# EAGLE design main (EAGLE 9.0.0)
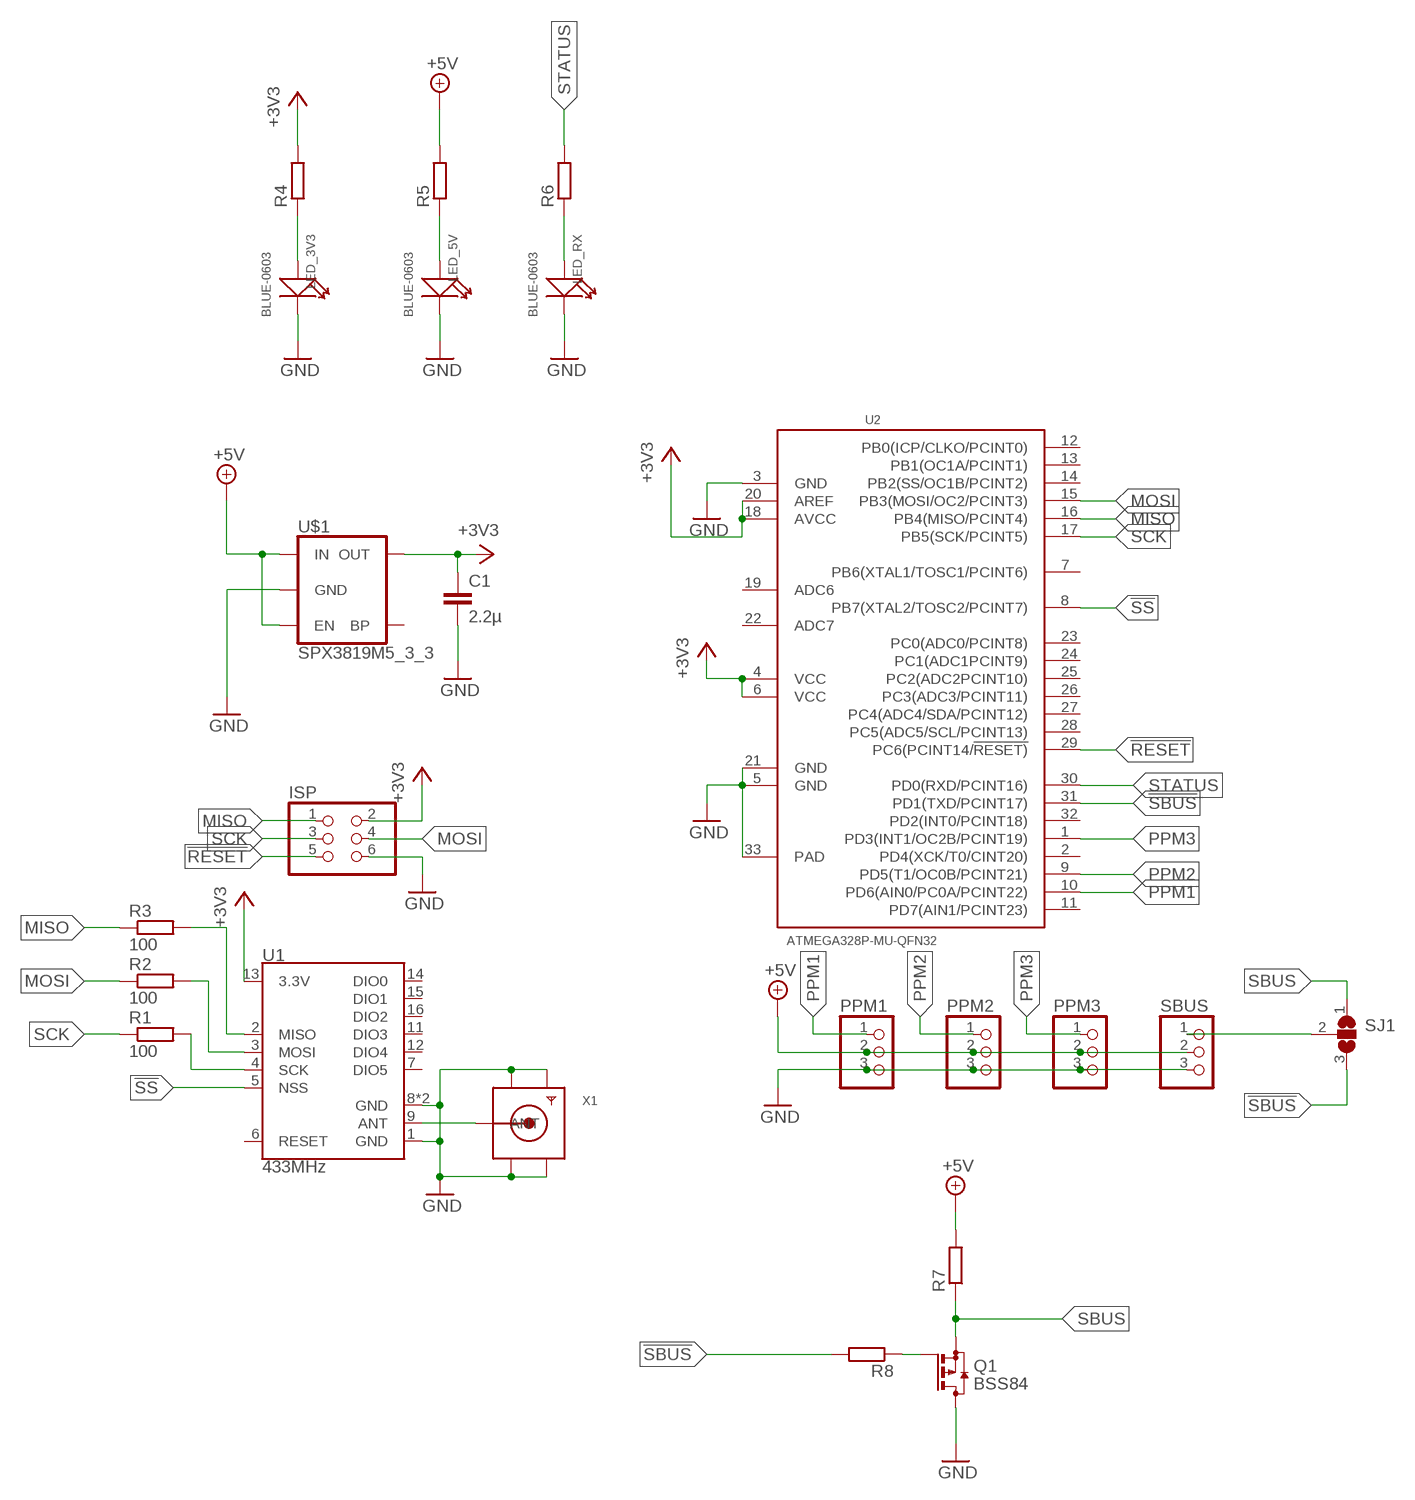
[diagram p0: schematic, sheet 1]

## Parts
C1  2.2µ  C-EUC0603  [C0603]
ISP  PINHD-2X3_2.54-SMD  [2X03SMD]
LED_3V3  BLUE-0603  SMD-LED-CLEAR-BLUE(0603)  [LED-0603]
LED_5V  BLUE-0603  SMD-LED-CLEAR-BLUE(0603)  [LED-0603]
LED_RX  BLUE-0603  SMD-LED-CLEAR-BLUE(0603)  [LED-0603]
PPM1  PINHD-1X3_2.54-SMD  [1X03SMD]
PPM2  PINHD-1X3_2.54-SMD  [1X03SMD]
PPM3  PINHD-1X3_2.54-SMD  [1X03SMD]
Q1  BSS84  [SOT23]
R1  100  R-EU_R0603  [R0603]
R2  100  R-EU_R0603  [R0603]
R3  100  R-EU_R0603  [R0603]
R4  R-EU_R0603  [R0603]
R5  R-EU_R0603  [R0603]
R6  R-EU_R0603  [R0603]
R7  R-EU_R0603  [R0603]
R8  R-EU_R0603  [R0603]
SBUS  PINHD-1X3_2.54-SMD  [1X03SMD]
SJ1  SJ2W  [SJ_2]
U1  433MHz  RFM69HCW-433  [RFM69HCW-XXXS2]
U2  ATMEGA328P-MU-QFN32  MCU-ATMEGA328P-MU(QFN32)  [QFN32G-0.5-5X5MM]
U$1  SPX3819M5_3_3  V_REG_SPX3819-SOT23-5  [SOT23-5]
X1  SMACONNECTOR_EDGE  [SMA_EDGELAUNCH]

## Nets
!RESET: ISP.5 U2.29(PC6(PCINT14/!RESET))
!SBUS: R8.2 SJ1.3 U2.31(PD1(TXD/PCINT17))
!SS: U1.5(NSS) U2.8(PB7(XTAL2/TOSC2/PCINT7))
+3V3: C1.1 ISP.2 R4.2 U1.13(3.3V) U2.4(VCC) U2.6(VCC) U2.18(AVCC) U2.20(AREF) U$1.5(OUT)
+5V: PPM1.2 PPM2.2 PPM3.2 R5.2 R7.2 SBUS.2 U$1.1(IN) U$1.3(EN)
GND: C1.2 ISP.6 LED_3V3.- LED_5V.- LED_RX.- PPM1.3 PPM2.3 PPM3.3 Q1.3(D) SBUS.3 U1.1(GND) U1.8(GND) U1.10(GND) U2.3(GND) U2.5(GND) U2.21(GND) U2.33(PAD) U$1.2(GND) X1.GND@1(GND4) X1.GND@2(GND3) X1.GND@3(GND2) X1.GND@4(GND1)
MISO: ISP.1 R3.1 U2.16(PB4(MISO/PCINT4))
MOSI: ISP.4 R2.1 U2.15(PB3(MOSI/OC2/PCINT3))
N$1: U1.9(ANT) X1.P(ANT)
N$2: R1.2 U1.4(SCK)
N$3: R2.2 U1.3(MOSI)
N$4: R3.2 U1.2(MISO)
N$5: LED_RX.+ R6.1
N$6: SBUS.1 SJ1.2
N$7: LED_3V3.+ R4.1
N$8: LED_5V.+ R5.1
N$10: Q1.1(G) R8.1
PPM1: PPM1.1 U2.10(PD6(AIN0/PC0A/PCINT22))
PPM2: PPM2.1 U2.9(PD5(T1/OC0B/PCINT21))
PPM3: PPM3.1 U2.1(PD3(INT1/OC2B/PCINT19))
SBUS: Q1.2(S) R7.1 SJ1.1
SCK: ISP.3 R1.1 U2.17(PB5(SCK/PCINT5))
STATUS: R6.2 U2.30(PD0(RXD/PCINT16))
Unconnected: U1.6(RESET) U1.7(DIO5) U1.11(DIO3) U1.12(DIO4) U1.14(DIO0) U1.15(DIO1) U1.16(DIO2) U2.2(PD4(XCK/T0/CINT20)) U2.7(PB6(XTAL1/TOSC1/PCINT6)) U2.11(PD7(AIN1/PCINT23)) U2.12(PB0(ICP/CLKO/PCINT0)) U2.13(PB1(OC1A/PCINT1)) U2.14(PB2(SS/OC1B/PCINT2)) U2.19(ADC6) U2.22(ADC7) U2.23(PC0(ADC0/PCINT8)) U2.24(PC1(ADC1PCINT9)) U2.25(PC2(ADC2PCINT10)) U2.26(PC3(ADC3/PCINT11)) U2.27(PC4(ADC4/SDA/PCINT12)) U2.28(PC5(ADC5/SCL/PCINT13)) U2.32(PD2(INT0/PCINT18)) U$1.4(BP)

## Library data of the parts
C1 = resistor:C-EU: CAPACITOR, European symbol
ISP = pinhead:PINHD-2X3: PIN HEADER
LED_3V3 LED_5V LED_RX = Seeed-LED:SMD-LED-CLEAR-BLUE(0603): 304090045; MPN: 19-217-BHC-ZL1M2RY-3T
PPM1-PPM3 SBUS = pinhead:PINHD-1X3: PIN HEADER
Q1 = transistor-small-signal:BSS84: P-CHANNEL MOS FET
R1-R8 = resistor:R-EU_: RESISTOR, European symbol
SJ1 = jumper:SJ2W: SMD solder JUMPER
U1 = SparkFun-RF:RFM69H: Hope RF RFM69H ISM Transceiver Module The RFM69H is a transceiver module capable of operation over a wide frequency range, including the 315,433,868 and 915MHz license-free ISM (Industry Scientific and Medical) frequency bands. All major RF communication parameters are programmable and most of them can be dynamically set. The RFM69H offers the unique advantage of programmable narrow-band and wide- band communication modes. The RFM69H is optimized for low power consumption while offering high RF output power and channelized operation.Compliance ETSI and FCC regulations. Datasheet <http://www.hoperf.cn/upload/docs/RF/SX/RFM69H_DataSheet_v1.3.pdf> SparkFun Products RFM69HCW Wireless Transceiver - 915MHz <https://www.sparkfun.com/products/13909> (COM-13909) RFM69HCW Wireless Transceiver - 434MHz <https://www.sparkfun.com/products/13910> (COM-13910) SparkFun RFM69 Breakout (915MHz) <https://www.sparkfun.com/products/12775> (WRL-12775) SparkFun RFM69 Breakout (434MHz) <https://www.sparkfun.com/products/12823> (WRL-12823); PROD_ID: IC-12053
U2 = Seeed-IC:MCU-ATMEGA328P-MU(QFN32): 310010005; MPN: ATMEGA328P-MU
U$1 = SparkFun-IC-Power:V_REG_SPX3819: SPX3819 Voltage Regulator 3.3V 500mA, 16V input Datasheet <https://www.exar.com/content/document.ashx?id=22106> SparkFun Products: SparkFun Serial Controlled Motor Driver <https://www.sparkfun.com/products/13911>; PROD_ID: VREG-13321
X1 = adafruit:SMACONNECTOR: SMA Connector 90° DIP SMA Connector, 50 Ohm (4UConnector: 07259)

## Board
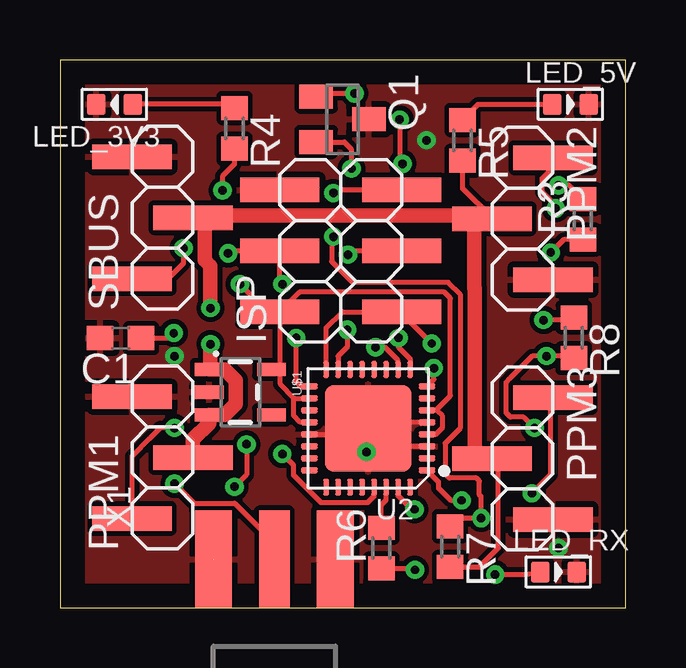
[diagram p1: board, top side]
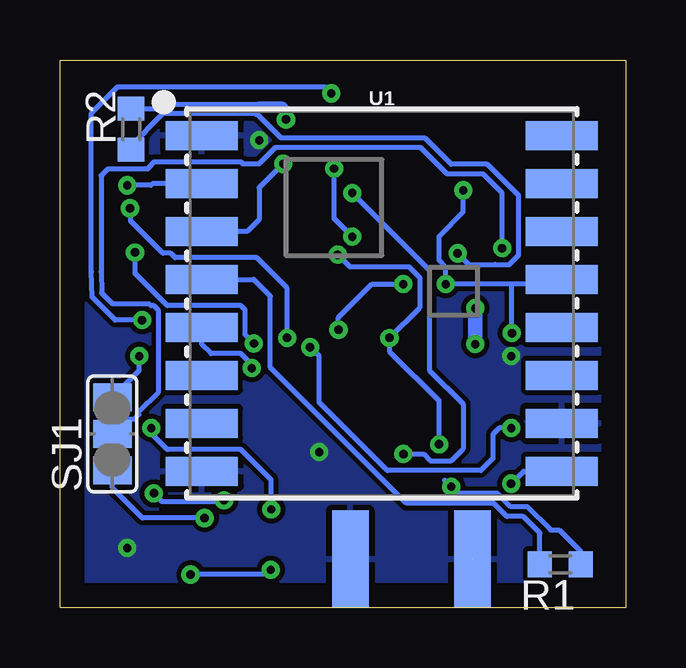
[diagram p2: board, bottom side, seen from below]

Size 23.57 x 22.85 mm. Coordinates in mm from the lower left corner, seen from the top.
Outline: 0,0 23.57,0 23.57,22.85 0,22.85 0,0
Copper layers (1*16): Top 0.035mm / dielectric 1.5mm / Bottom 0.035mm
Design rules "default *": minimum track width 6mil, minimum drill 0.35mm, track to track 8mil, track to pad 8mil, pad to pad 8mil, via to via 8mil, smd to smd 8mil, copper to edge 40mil, drill to drill 6mil, minimum pad ring 10mil, minimum via ring 8mil, stop-mask expansion 4mil, vias tented up to drill 0mil, thermal gap 10mil

### Footprints (pad centres in the part's own frame; a part is rotated, then mirrored left to right if it is on the bottom)
C0603 = smd 1.1 x 1: 1 -0.85,0; 2 0.85,0
2X03SMD = smd 1.016 x 3.302: 1 -1.27,-3.81; 2 -1.27,1.27; 3 1.27,-3.81; 4 1.27,1.27; 5 3.81,-3.81; 6 3.81,1.27
LED-0603 = smd 0.762 x 0.889: + -0.762,0; - 0.762,0
1X03SMD = smd 1.016 x 3.302: 1 -1.27,1.27; 2 1.27,-1.27; 3 3.81,1.27
SOT23 = smd 1 x 1.4: 1 -0.95,-1.1; 2 0.95,-1.1; 3 0,1.1
R0603 = smd 1 x 1.1: 1 -0.85,0; 2 0.85,0
SJ_2 = smd 1.168 x 1.6: 1 -1.524,0; 2 0,0; 3 1.524,0
RFM69HCW-XXXS2 = smd 3 x 1.2: 1 -7.5,7; 2 -7.5,5; 3 -7.5,3; 4 -7.5,1; 5 -7.5,-1; 6 -7.5,-3; 7 -7.5,-5; 8 -7.5,-7; 9 7.5,-7; 10 7.5,-5; 11 7.5,-3; 12 7.5,-1; 13 7.5,1; 14 7.5,3; 15 7.5,5; 16 7.5,7
QFN32G-0.5-5X5MM = smd 0.7 x 0.25: 1 -2.45,1.75; 2 -2.45,1.25; 3 -2.45,0.75; 4 -2.45,0.25; 5 -2.45,-0.25; 6 -2.45,-0.75; 7 -2.45,-1.25; 8 -2.45,-1.75; 17 2.45,-1.75; 18 2.45,-1.25; 19 2.45,-0.75; 20 2.45,-0.25; 21 2.45,0.25; 22 2.45,0.75; 23 2.45,1.25; 24 2.45,1.75 | smd 0.25 x 0.7: 9 -1.75,-2.45; 10 -1.25,-2.45; 11 -0.75,-2.45; 12 -0.25,-2.45; 13 0.25,-2.45; 14 0.75,-2.45; 15 1.25,-2.45; 16 1.75,-2.45; 25 1.75,2.45; 26 1.25,2.45; 27 0.75,2.45; 28 0.25,2.45; 29 -0.25,2.45; 30 -0.75,2.45; 31 -1.25,2.45; 32 -1.75,2.45 | smd 3.6 x 3.6: 33 0,0
SOT23-5 = smd 0.55 x 1.2: 1 -0.95,-1.3; 2 0,-1.3; 3 0.95,-1.3; 4 0.95,1.3; 5 -0.95,1.3
SMA_EDGELAUNCH = smd 4.064 x 1.524: GND@1 2.032,-2.54; GND@2 2.032,2.54 | smd 4.064 x 1.524 bottom: GND@3 2.032,2.54; GND@4 2.032,-2.54 | smd 4.064 x 1.27: P 2.032,0

### Placement (x,y rotation side)
C1  2.52,11.25 180 top
ISP  10.43,13.62 90 top
LED_3V3  2.27,21 180 top
LED_5V  21.27,21 0 top
LED_RX  20.77,1.5 0 top
PPM1  4.27,5 90 top
PPM2  19.27,17.5 270 top
PPM3  19.27,7.5 270 top
Q1  11.77,20.37 270 top
R1  2.73,1.82 180 bottom
R2  20.61,19.96 90 bottom
R3  21.78,16.21 90 top
R4  7.27,20 270 top
R5  16.77,19.5 270 top
R6  13.39,2.5 90 top
R7  16.26,2.56 270 top
R8  21.41,11.27 270 top
SBUS  4.27,15 90 top
SJ1  21.39,7.25 90 bottom
U1  10.16,12.7 0 bottom
U2  12.84,7.49 180 top
U$1  7.52,9 270 top
X1  8.93,0 90 top

### Tracks (layer width: path | path; a pad name or v marks a point on that pad's centre or on a via)
!RESET  (via drill 0.35)
  Top 0.203: ISP.5 11.52,17.43 v11.39,17.3 | U2.29 13.09,4.67 12.8,4.38 10.88,4.38 9.73,5.53 9.73,5.95 v9.27,6.42
  Bottom 0.203: v11.39,17.3 8.18,14.09 8.18,9.91 6.77,8.5 6.77,6.64 7.27,6.14 8.14,6.14 8.41,6.42 v9.27,6.42
!SBUS  (via drill 0.35)
  Top 0.203: v19.77,7.5 19.31,7.96 18.76,7.96 18.58,8.14 18.58,9.4 18.76,9.58 18.77,9.58 19.69,10.5 v20.27,10.5 21.32,10.5 R8.2 | v14.77,4.11 14.65,4.11 14.09,4.67 U2.31
  Bottom 0.203: v19.77,7.5 19.77,7.28 19.1,6.61 16.03,6.61 14.77,5.34 v14.77,4.11 | SJ1.3 20.27,9.9 v20.27,10.5
!SS  (via drill 0.35)
  Top 0.203: U2.8 15.58,9.53 v15.58,10
  Bottom 0.203: U1.5 17.66,10.99 17.27,10.61 16.03,10.61 15.58,10.15 v15.58,10
+3V3  (via drill 0.35)
  Top 0.203: ISP.2 9.16,10.04 9.12,10 | U$1.5 9.18,9.79 9.18,9.33 9.77,8.74 | 9.77,8.74 U2.18 | 8.74,12.35 ISP.2 | R4.2 7.27,18.5 6.77,18 v6.77,17.41 | C1.1 4.54,11.25 v4.74,11.46 | U2.20 10.02,7.74 9.73,8.03 9.73,8.71 9.77,8.74 | U2.4 15.66,7.24 15.95,7.53 15.95,8 15.71,8.24 U2.6 15.66,8.24 16.26,8.84 16.26,12.92 16.02,13.16 9.97,13.16 ISP.2 | 7.23,13.5 v7.5,13.5 8.65,12.35 ISP.2
  Top 0.305: ISP.2 9.07,12.26 | 9.12,10 U$1.5
  Bottom 0.203: U1.13 2.86,13.5 4.77,13.5 | 4.77,13.5 v7.5,13.5 7.5,14.22 7.77,14.5 7.77,15.5 6.77,16.5 v6.77,17.41 | v4.74,11.46 4.74,13.47 4.77,13.5
+5V  (via drill 0.35)
  Top 0.203: R5.2 16.77,17.5 18,16.27 | PPM3.2 18.27,5.96 18.27,2.5 17.48,1.71 R7.2
  Top 0.305: PPM2.2 17.66,16.57 | 7.17,9 7.17,9.42 6.64,9.95 U$1.1
  Top 0.61: SBUS.2 5.64,16.37 5.77,16.37 | 17.27,16.37 17.86,16.37 PPM2.2 18,16.27 | 17.27,16.37 5.77,16.37 | PPM3.2 17.8,6.03 17.27,6.03 17.28,6.03 17.28,13.34 17.27,13.35 17.27,16.37 | v6.27,11 6.27,10 U$1.1 6.86,9.95 7.32,9.48 7.32,8.52 6.86,8.05 U$1.3 6.22,7.69 5.54,7.02 PPM1.2 | v6.27,12.5 6.27,14.26 6.03,14.5 6.03,16.1 5.77,16.37
  Bottom 0.61: v6.27,12.5 v6.27,11
GND  (via drill 0.35)  (1 unrouted)
  Top 0.203: U2.21 12.59,7.24 U2.33 | U2.5 13.09,7.74 U2.33 | U2.3 14.27,6.74 14.02,6.74 13.59,6.74 U2.33
  Bottom 0.203: U1.8 17.54,5.7
  other vias: 20.77,2.5 12.77,6.5 15.27,19.5 4.77,10.5
  pour Top: -0.23,23 -0.23,0 0.27,-0.5 23.77,-0.5 23.77,23
  pour Bottom: -0.23,23 -0.23,0 0.27,-0.5 23.77,-0.5 24.27,0 24.27,22.5 23.77,23
MISO  (via drill 0.35)
  Top 0.203: ISP.1 12.99,12.35 | R3.1 20.98,15.36 v20.45,14.82 | ISP.1 11.75,12.35 11.08,11.69 11.09,11.68 U2.16 | v15.49,11.03 14.24,12.28 ISP.1
  Bottom 0.203: v20.45,14.82 20.45,13.96 19.1,12.61 16.03,12.61 15.86,12.43 15.86,11.39 v15.49,11.03
MOSI  (via drill 0.35)
  Top 0.203: v9.27,13.5 9.16,13.61 ISP.4 7.11,14.89 v7,14.78 | U2.15 11.59,10.5 11.97,10.88 v11.97,11.6
  Bottom 0.203: v9.27,13.5 10.57,13.5 11.97,12.11 v11.97,11.6 | R2.1 20.61,19.28 19.29,20.61 15.45,20.61 15.44,20.59 15.35,20.59 14.36,19.61 8.38,19.61 7.27,18.5 5.77,18.5 4.46,17.2 4.46,14.71 4.86,14.32 5.43,14.32 5.44,14.33 6.55,14.33 v7,14.78
N$1  (via drill 0.35)
  Top 0.203: v4.77,5.18 5.59,4.37 7.28,4.37 8.93,2.72 X1.P
  Bottom 0.203: v4.77,5.18 4.25,5.7 U1.9
N$2
  Bottom 0.203: U1.4 15.51,13.7 14.81,13 14.81,10.04 9.14,4.37 5.5,4.37 4.95,3.82 4.27,3.82 3.58,3.13 R1.2
N$3  (via drill 0.35)
  Top 0.203: v14.27,18.52 14.17,18.62 14.17,20.34 v14.15,20.36
  Bottom 0.203: R2.2 19.66,20.81 19.45,21.01 15.28,21.01 15.27,21 14.27,21 14.15,20.88 v14.15,20.36 | U1.3 15.77,15.7 15.27,16.2 15.27,17.52 v14.27,18.52
N$4  (via drill 0.35)
  Top 0.203: R3.2 21.22,17.62 v20.77,17.62
  Bottom 0.203: v20.77,17.62 19.77,17.62 19.69,17.7 U1.2
N$5  (via drill 0.35)
  Top 0.203: R6.1 14.73,1.65 v14.79,1.59 | v18.13,1.39 19.4,1.39 LED_RX.+
  Bottom 0.203: v14.79,1.59 14.98,1.39 v18.13,1.39
N$6  (via drill 0.35)
  Top 0.203: v5.15,15 5.15,14.38 4.5,13.73 SBUS.1
  Bottom 0.203: SJ1.2 20.75,7.89 20.46,7.89 20.28,8.07 20.28,8.2 19.46,9.01 19.46,12.4 19.67,12.6 19.78,12.6 19.86,12.68 21.38,12.68 21.83,13.14 21.85,14.03 21.85,18.03 21.57,18.3 19.93,18.3 19.75,18.48 19.75,18.5 19.65,18.61 16.03,18.61 15.94,18.52 15.29,18.52 14.6,19.2 8.55,19.2 7.44,18.09 5.94,18.09 5.15,17.3 v5.15,15
N$7
  Top 0.203: R4.1 7.12,21 LED_3V3.+
N$8
  Top 0.203: R5.1 17.42,21 LED_5V.+
N$10  (via drill 0.35)
  Top 0.203: R8.1 21.29,12 v20.15,12 | Q1.1 10.8,21.46 v12.27,21.46
  Bottom 0.203: v12.27,21.46 12.55,21.73 21.17,21.73 22.26,20.64 22.26,14.02 22.24,12.97 21.27,12 v20.15,12
PPM1  (via drill 0.35)
  Top 0.203: PPM1.1 3,6.32 3.76,7.08 3.77,7.08 4.19,7.5 v4.77,7.5 | U2.10 14.09,10.31 13.53,10.87 v13.14,10.87
  Bottom 0.203: v4.77,7.5 5.27,7.5 5.52,7.25 5.52,6.25 6.04,5.74 9.93,5.74 12.77,8.57 12.77,10.5 v13.14,10.87
PPM2  (via drill 0.35)
  Top 0.203: v14.11,11.26 14.11,10.87 14.59,10.38 U2.9 | v20.65,16.66 20.65,16.77 20.09,17.34 20.09,17.91 20.54,18.36 PPM2.1
  Bottom 0.203: v14.11,11.26 14.11,13.34 15.38,14.61 18.77,14.61 18.96,14.79 19.29,14.79 20.63,16.14 20.63,16.64 v20.65,16.66
PPM3  (via drill 0.35)
  Top 0.203: 19.77,8.5 20.04,8.77 PPM3.1 20.45,8.68 20.45,5.57 v19.66,4.78 | v16.73,4.49 16.28,4.49 15.77,5 15.77,5.26 U2.1
  Bottom 0.203: v19.66,4.78 19.31,4.43 16.79,4.43 v16.73,4.49
SBUS  (via drill 0.35)
  Top 0.203: v12.15,18.32 12.15,19.12 11.85,19.42 Q1.2 | R7.1 16.6,3.75 v17.55,3.75 17.53,3.76 17.53,4.66 17.48,4.71 17.48,5.29 17.35,5.42 16.22,5.42 16.04,5.6 16.04,6.86 16.67,7.49 16.67,13.09 16.19,13.57 12.2,13.57 11.32,14.45 11.32,15.41 v11.39,15.48
  Bottom 0.203: SJ1.1 21.39,5 20.14,3.75 v17.55,3.75 | v11.39,15.48 12.15,16.23 v12.15,18.32
SCK  (via drill 0.35)
  Top 0.203: U2.17 10.03,9.24 9.84,9.43 v9.84,11.26 | v7.77,6.82 7.77,5.55 v7.27,5.05 | ISP.3 12.16,14.89 v12,14.73
  Bottom 0.203: R1.1 1.88,2.36 2.77,3.25 3.13,3.25 4.1,4.22 4.78,4.22 5.33,4.78 6.99,4.78 v7.27,5.05 7.55,5.33 | v7.77,6.82 7.77,8.63 9.84,10.7 v9.84,11.26 8.59,12.52 8.59,13.78 9.04,14.23 11.5,14.23 v12,14.73
STATUS
  Top 0.203: U2.30 13.59,4.5 13.39,4.3 R6.2